# EAGLE design Grove - Relay v1.2 (EAGLE 6.4)
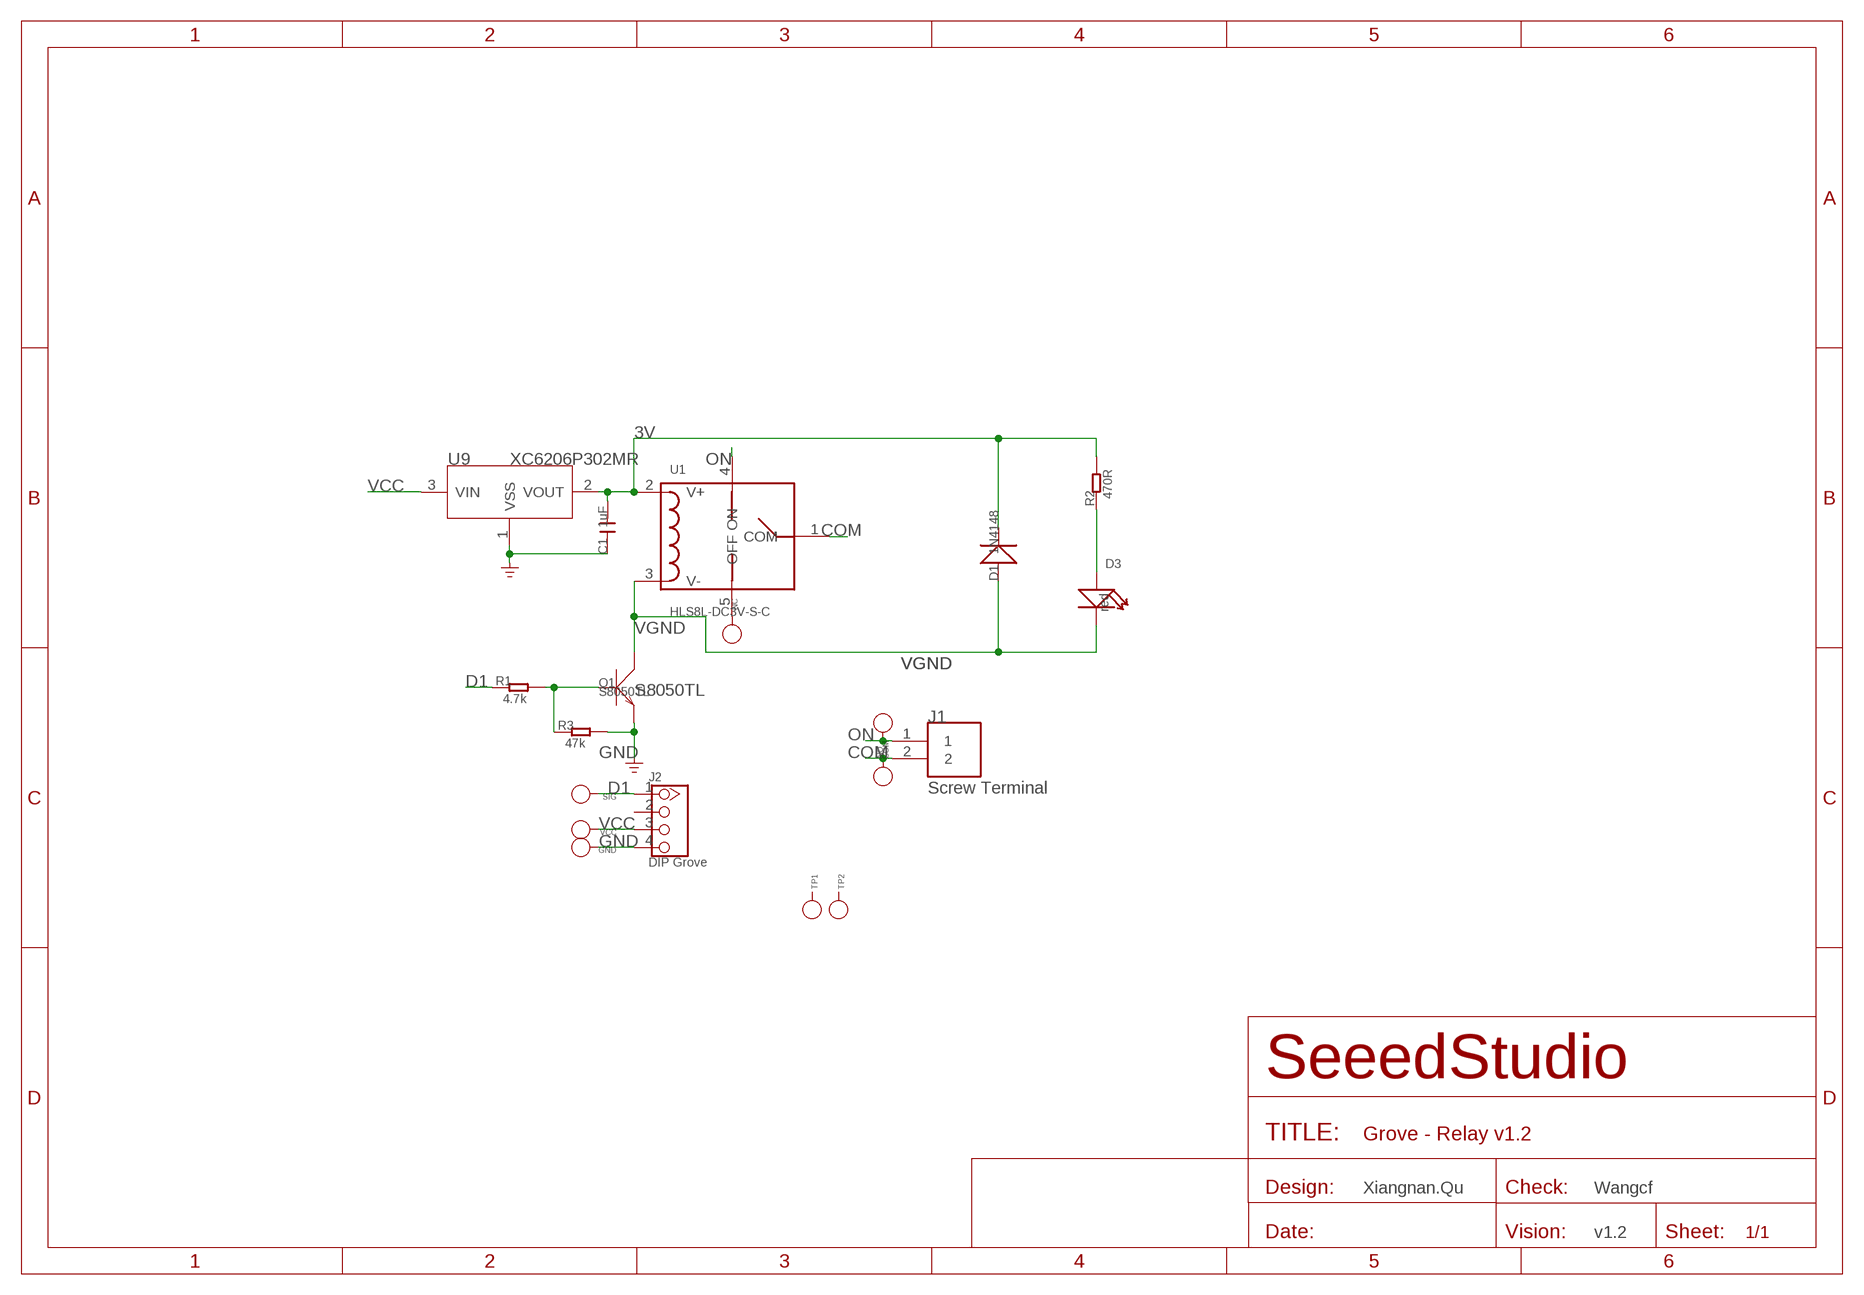
[diagram p0: schematic, sheet 1]

## Parts
C1  1uF  C-0603  [C0603]
COM  PAD-TEST-POINT'4545'  [TP_4545]
D1  1N4148  D'1N4148-SMD'  [LL-34]
D3  red  LED'0603'  [LED-0603]
GND  PAD-TEST-POINT'4545'  [TP_4545]
J1  Screw Terminal  CON2  [CON2]
J2  DIP Grove  TWIG_2.0  [2.0_1X4]
NC  PAD-TEST-POINT'4545'  [TP_4545]
NO  PAD-TEST-POINT'4545'  [TP_4545]
Q1  S8050TL  TRANSISTOR-NPN-SOT23  [SOT23]
R1  4.7k  R-0603  [R0603]
R2  470R  R-0603  [R0603]
R3  47k  R-0603  [R0603]
SIG  PAD-TEST-POINT'4545'  [TP_4545]
TP1  PAD-TEST-POINT'4545'  [TP_4545]
TP2  PAD-TEST-POINT'4545'  [TP_4545]
U1  HLS8L-DC3V-S-C  RELAY  [RELAY]
U9  XC6206P302MR  XC6206MR  [SOT23]
VCC  PAD-TEST-POINT'4545'  [TP_4545]

## Nets
3V: C1.2 D1.C(-) R2.2 U1.2(V+) U9.2(VOUT)
COM: COM.T J1.2 U1.1(COM)
D1: J2.1 R1.1 SIG.T
GND: C1.1 GND.T J2.4 Q1.2(E) R3.2 U9.1(VSS)
N$1: D3.+ R2.1
N$2: Q1.1(B) R1.2 R3.1
N$3: NC.T U1.5(OFF)
ON: J1.1 NO.T U1.4(ON)
VCC: J2.3 U9.3(VIN) VCC.T
VGND: D1.A(+) D3.- Q1.3(C) U1.3(V-)
Unconnected: J2.2 TP1.T TP2.T

## Notes on the sheet
- S8050TL
- Xiangnan.Qu | Wangcf
- v1.2

## Library data of the parts
C1 = Discrete:C*: Ceramic Capacitors
COM GND NC NO SIG TP1 TP2 VCC = Discrete:PAD-TEST-POINT; PARTNO: DNP
D1 = Discrete:D*
D3 = Discrete:LED*
J1 = seeedleo:CON2
J2 = CONNECTER:TWIG_2.0
Q1 = Discrete:TRANSISTOR-NPN*: NPN audion
R1-R3 = Discrete:R*
U1 = Seeed:RELAY
U9 = IC:XC6206: LOW ESR Cap.Compatible Positive Voltage Regulators

## Board
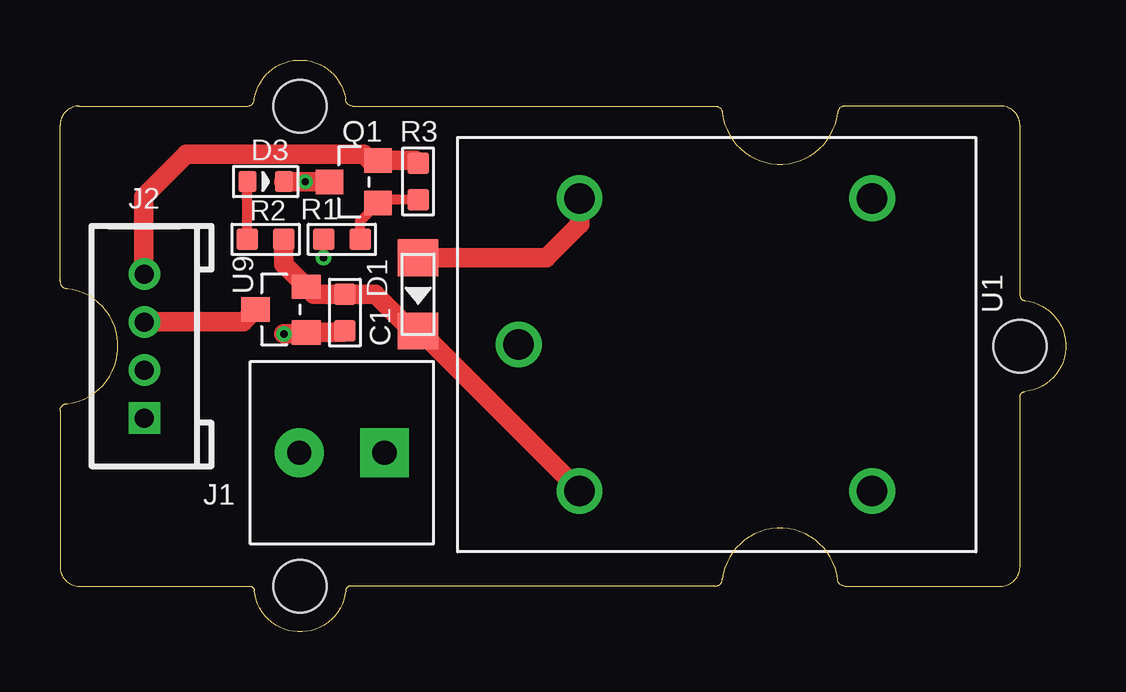
[diagram p1: board, top side]
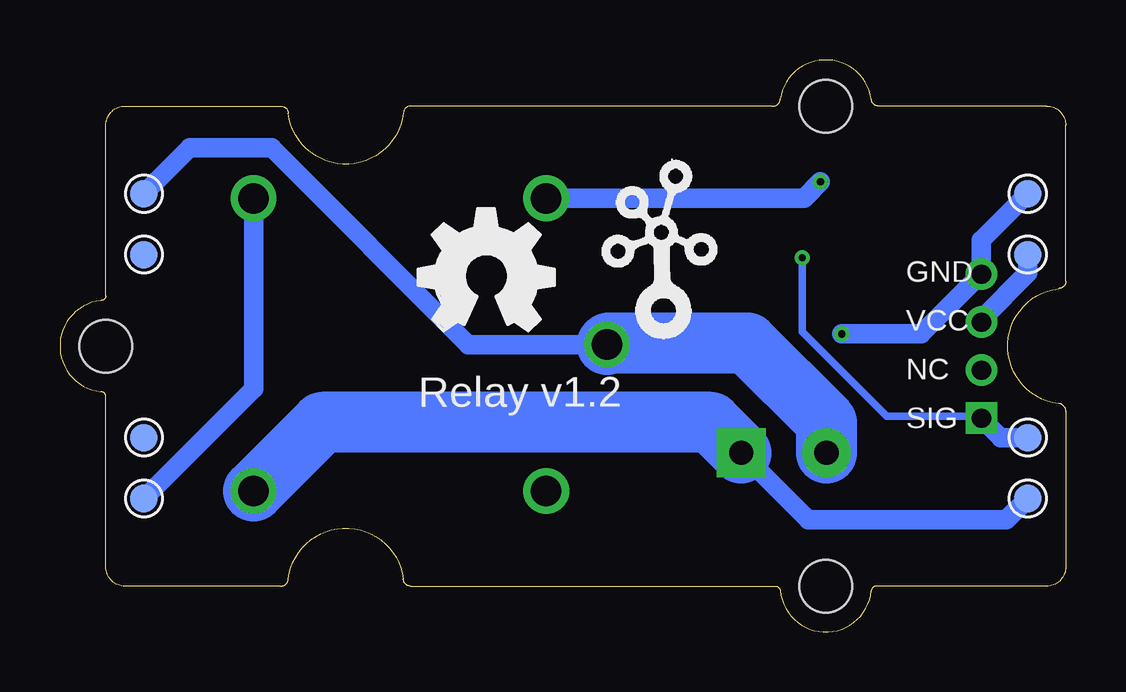
[diagram p2: board, bottom side, seen from below]

Size 41.91 x 23.83 mm. Coordinates in mm from the lower left corner, seen from the top.
Copper layers (1*16): Top 0.035mm / dielectric 1.5mm / Bottom 0.035mm
Design rules "default": minimum track width 6mil, minimum drill 12mil, track to track 6mil, track to pad 6mil, pad to pad 6mil, via to via 6mil, smd to smd 0mil, copper to edge 10mil, drill to drill 10mil, minimum pad ring 10mil, minimum via ring 6mil, stop-mask expansion 2mil, vias tented up to drill 100mil, thermal gap 10mil

### Footprints (pad centres in the part's own frame; a part is rotated, then mirrored left to right if it is on the bottom)
C0603 = smd 0.889 x 0.889: 1 -0.762,0; 2 0.762,0
TP_4545 = smd 1.143 x 1.143: T 0,0
LL-34 = smd 1.524 x 1.676: A -1.524,0; C 1.524,0
LED-0603 = smd 0.762 x 0.889: + -0.762,0; - 0.762,0
CON2 = drill 1.016 pad 2.032 square: 1 0,1.778 | drill 1.016 pad 2.032: 2 0,-1.778
2.0_1X4 = drill 0.8 pad 1.27 square: 1 -3,0 | drill 0.8 pad 1.27: 2 -1,0; 3 1,0; 4 3,0
SOT23 = smd 1.016 x 1.143: 1 -0.889,-1.016; 2 0.889,-1.016; 3 0,1.016
R0603 = smd 0.889 x 0.889: 1 -0.762,0; 2 0.762,0
RELAY = drill 1.27: 1 -2.54,-6.096; 2 0,-12.192; 3 0,0; 4 12.192,-12.192; 5 12.192,0
SOT23' = smd 1.016 x 1.2: 1 -0.95,-1.06; 2 0.95,-1.06; 3 0,1.06
GROVE-TEST-PLATFORM = hole 2.2: -10,-10; -10,10; 20,0

### Placement (x,y rotation side)
C1  11.87,13.31 90 top
COM  38.41,18.26 0 bottom
D1  14.92,14.07 270 top
D3  8.57,18.77 0 top
GND  1.59,18.26 0 bottom
J1  11.74,7.46 270 top
J2  3.52,11.91 90 top
NC  38.41,5.56 0 bottom
NO  1.59,5.56 0 bottom
Q1  12.24,18.75 90 top
R1  11.74,16.35 0 top
R2  8.57,16.35 0 top
R3  14.92,18.77 90 top
SIG  1.59,8.1 0 bottom
TP1  38.41,15.72 0 bottom
TP2  38.41,8.1 0 bottom
U1  21.65,18.07 0 top
U9  XC6206P302MR  [SOT23']  9.21,13.43 90 top
U$2  [OSHW_FILLX200_NOTEXT]  26.98,12.54 0 bottom
U$3  [GROVE-TEST-PLATFORM]  20,11.91 0 top
U$5  [TWIGLOGO]  16.82,13.18 0 bottom
VCC  1.59,15.72 0 bottom

### Tracks (layer width: path | path; a pad name or v marks a point on that pad's centre or on a via)
3V
  Top 0.813: U1.2 14.98,12.54 D1.C 14.67,12.54 13.14,14.07 C1.2 10.58,14.07 U9.2 9.33,15.32 R2.2
COM
  Bottom 0.813: U1.1 24.89,11.97 33.08,20.16 36.51,20.16 COM.T
  Bottom 2.54: J1.2 9.97,8.73 13.27,12.04 19.05,12.04 U1.1
D1  (via drill 0.3 pad 0.64)
  Top 0.305: R1.1 v10.98,15.59
  Bottom 0.305: v10.98,15.59 10.98,12.5 7.47,8.99 3.59,8.99 J2.1
  Bottom 0.813: SIG.T 2.7,8.1 J2.1
GND  (via drill 0.3 pad 0.64)
  Top 0.813: R3.2 14.81,19.64 Q1.2 12.9,19.64 12.65,19.89 5.25,19.89 3.49,18.13 3.49,14.93 J2.4 | v9.33,12.42 10.2,12.42 U9.1 11.81,12.48 C1.1
  Bottom 0.813: GND.T 3.52,16.33 J2.4 3.56,14.96 3.56,14.88 6.03,12.42 v9.33,12.42
N$1
  Top 0.406: R2.1 D3.+
N$2
  Top 0.406: R1.2 12.51,17.12 Q1.1 13.4,18 R3.1
N$3
  Bottom 0.813: NC.T 33.84,10.13 U1.5
ON
  Bottom 0.813: NO.T 2.47,4.67 10.73,4.67 J1.1
  Bottom 2.54: U1.4 30.99,8.73 14.79,8.73 J1.1
VCC
  Top 0.813: J2.3 3.53,12.92 7.64,12.92 U9.3
  Bottom 0.813: VCC.T 1.59,14.96 3.49,13.05 3.49,12.93 J2.3
VGND  (via drill 0.3 pad 0.64)
  Top 0.813: D1.A 20.25,15.59 21.65,16.99 U1.3 | D3.- 10.21,18.77 v10.22,18.75 Q1.3
  Bottom 0.813: U1.3 10.91,18.07 v10.22,18.75

### Text on the board
bPlace: GND | VCC | NC | SIG | Relay v1.2